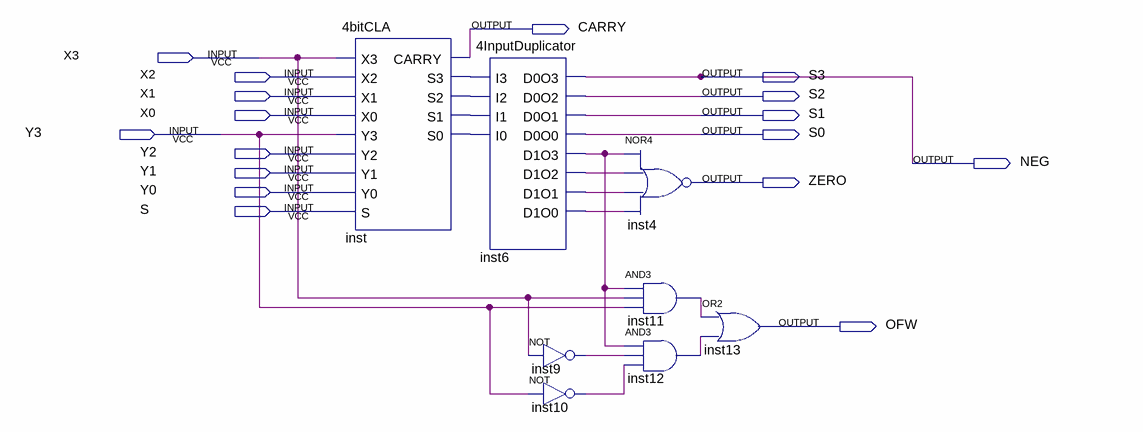
[diagram p0: schematic sheet]
// Quartus schematic 4bitCLAALU.bdf as structural Verilog: 8 symbols, 17 pins
module \4bitCLAALU  (
  input  X3,
  input  X2,
  input  X1,
  input  X0,
  input  Y3,
  input  Y2,
  input  Y1,
  input  Y0,
  input  S,
  output CARRY,
  output S3,
  output S2,
  output S1,
  output S0,
  output NEG,
  output ZERO,
  output OFW
);

  wire inst6_d1o0, inst6_d1o1, inst6_d1o2, inst6_d1o3, inst9_out, inst10_out, inst11_out, inst12_out,
       inst_s0, inst_s1, inst_s2, inst_s3;

  \4bitCLA  inst (
    .X3(X3), .X2(X2), .X1(X1), .X0(X0), .Y3(Y3), .Y2(Y2), .Y1(Y1), .Y0(Y0), .S(S), .CARRY(CARRY),
    .S3(inst_s3), .S2(inst_s2), .S1(inst_s1), .S0(inst_s0));
  \4InputDuplicator  inst6 (
    .I3(inst_s3), .I2(inst_s2), .I1(inst_s1), .I0(inst_s0), .D0O3(NEG), .D0O2(S2), .D0O1(S1), .D0O0(S0),
    .D1O3(inst6_d1o3), .D1O2(inst6_d1o2), .D1O1(inst6_d1o1), .D1O0(inst6_d1o0));
  not inst9 (inst9_out, X3);
  not inst10 (inst10_out, Y3);
  nor inst4 (ZERO, inst6_d1o3, inst6_d1o2, inst6_d1o1, inst6_d1o0);
  and inst11 (inst11_out, inst6_d1o3, X3, Y3);
  and inst12 (inst12_out, inst6_d1o3, inst9_out, inst10_out);
  or inst13 (OFW, inst11_out, inst12_out);

  assign S3 = NEG;
endmodule
